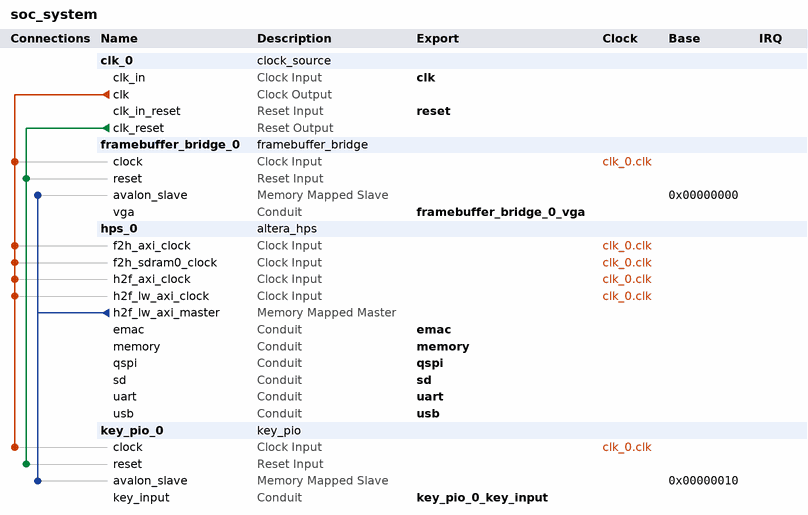
[diagram p0: system contents]
# Platform Designer (Qsys) system soc_system, Cyclone V 5CSXFC6D6F31C6
# Parameters at their usual value, and those the tool derives, are not listed.
package require -exact qsys 23.1
create_system soc_system
set_project_property DEVICE_FAMILY {Cyclone V}
set_project_property DEVICE 5CSXFC6D6F31C6

add_instance clk_0 clock_source 23.1
set_instance_parameter_value clk_0 clockFrequency 50000000
set_instance_parameter_value clk_0 resetSynchronousEdges DEASSERT

add_instance framebuffer_bridge_0 framebuffer_bridge 1.0

add_instance hps_0 altera_hps 23.1
set_instance_parameter_value hps_0 MEM_VENDOR Micron
set_instance_parameter_value hps_0 MEM_FORM_FACTOR Discrete
set_instance_parameter_value hps_0 HPS_MAIN_CLOCK 800.0
set_instance_parameter_value hps_0 F2H_LW_AXI_CLOCK 100.0

add_instance key_pio_0 key_pio 1.0

# connections
add_connection clk_0.clk framebuffer_bridge_0.clock clock
add_connection clk_0.clk hps_0.f2h_axi_clock clock
add_connection clk_0.clk hps_0.f2h_sdram0_clock clock
add_connection clk_0.clk hps_0.h2f_axi_clock clock
add_connection clk_0.clk hps_0.h2f_lw_axi_clock clock
add_connection clk_0.clk key_pio_0.clock clock
add_connection clk_0.clk_reset framebuffer_bridge_0.reset reset
add_connection clk_0.clk_reset key_pio_0.reset reset
add_connection hps_0.h2f_lw_axi_master framebuffer_bridge_0.avalon_slave avalon
set_connection_parameter_value hps_0.h2f_lw_axi_master/framebuffer_bridge_0.avalon_slave baseAddress 0x00000000
add_connection hps_0.h2f_lw_axi_master key_pio_0.avalon_slave avalon
set_connection_parameter_value hps_0.h2f_lw_axi_master/key_pio_0.avalon_slave baseAddress 0x00000010

# exported interfaces
add_interface clk clock sink
set_interface_property clk EXPORT_OF clk_0.clk_in
add_interface reset reset sink
set_interface_property reset EXPORT_OF clk_0.clk_in_reset
add_interface memory conduit end
set_interface_property memory EXPORT_OF hps_0.memory
add_interface emac conduit end
set_interface_property emac EXPORT_OF hps_0.emac
add_interface qspi conduit end
set_interface_property qspi EXPORT_OF hps_0.qspi
add_interface sd conduit end
set_interface_property sd EXPORT_OF hps_0.sd
add_interface uart conduit end
set_interface_property uart EXPORT_OF hps_0.uart
add_interface usb conduit end
set_interface_property usb EXPORT_OF hps_0.usb
add_interface key_pio_0_key_input conduit end
set_interface_property key_pio_0_key_input EXPORT_OF key_pio_0.key_input
add_interface framebuffer_bridge_0_vga conduit end
set_interface_property framebuffer_bridge_0_vga EXPORT_OF framebuffer_bridge_0.vga

save_system soc_system.qsys
